# EAGLE schematic Aquila-2019-ex (EAGLE 9.2.1)
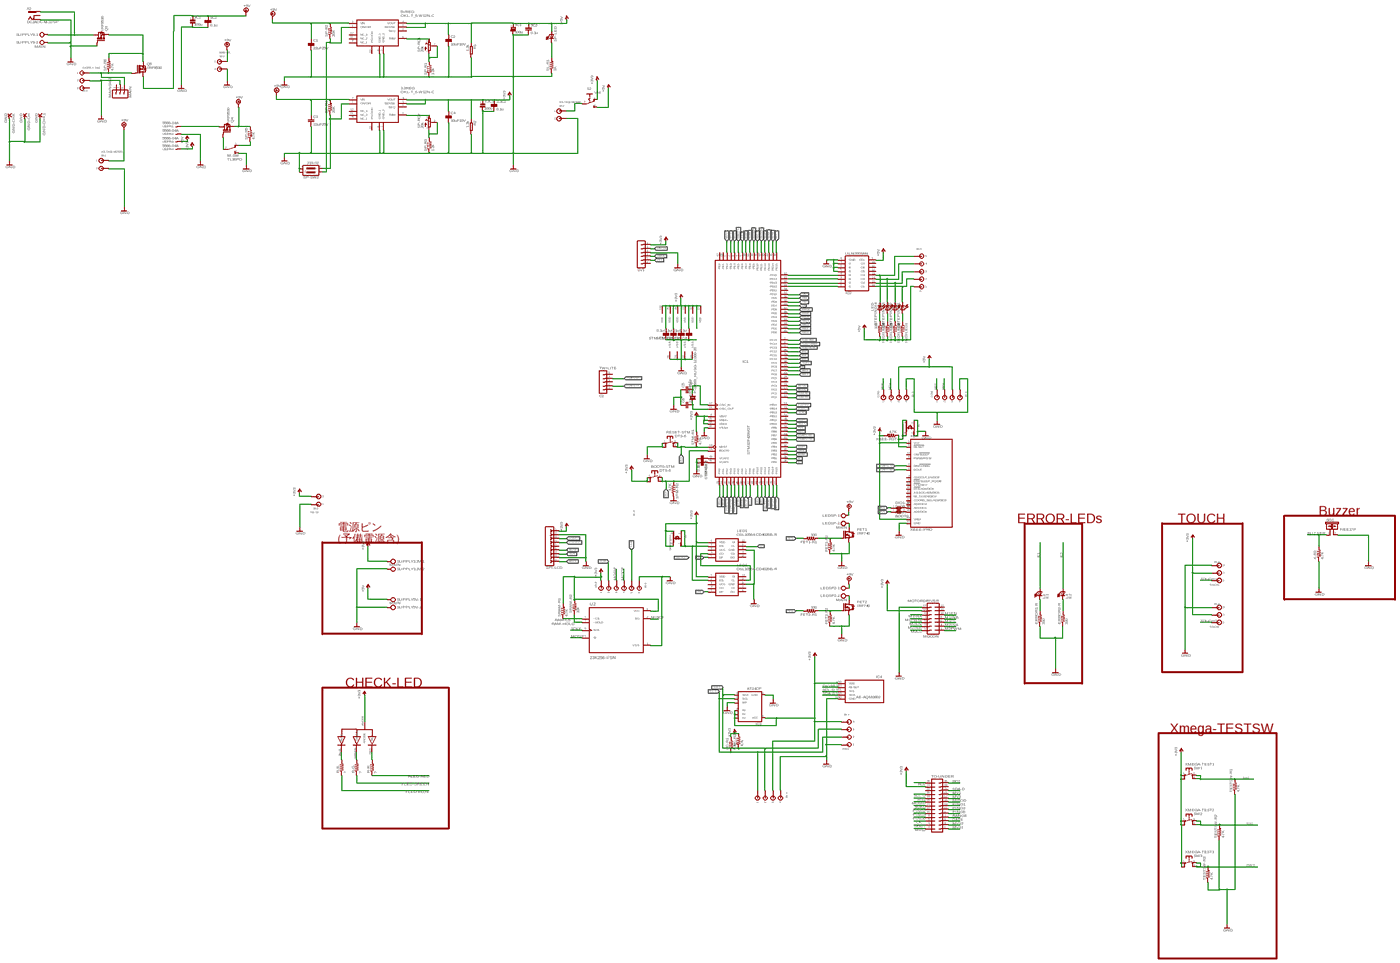
[diagram p0: schematic, sheet 1, overview]
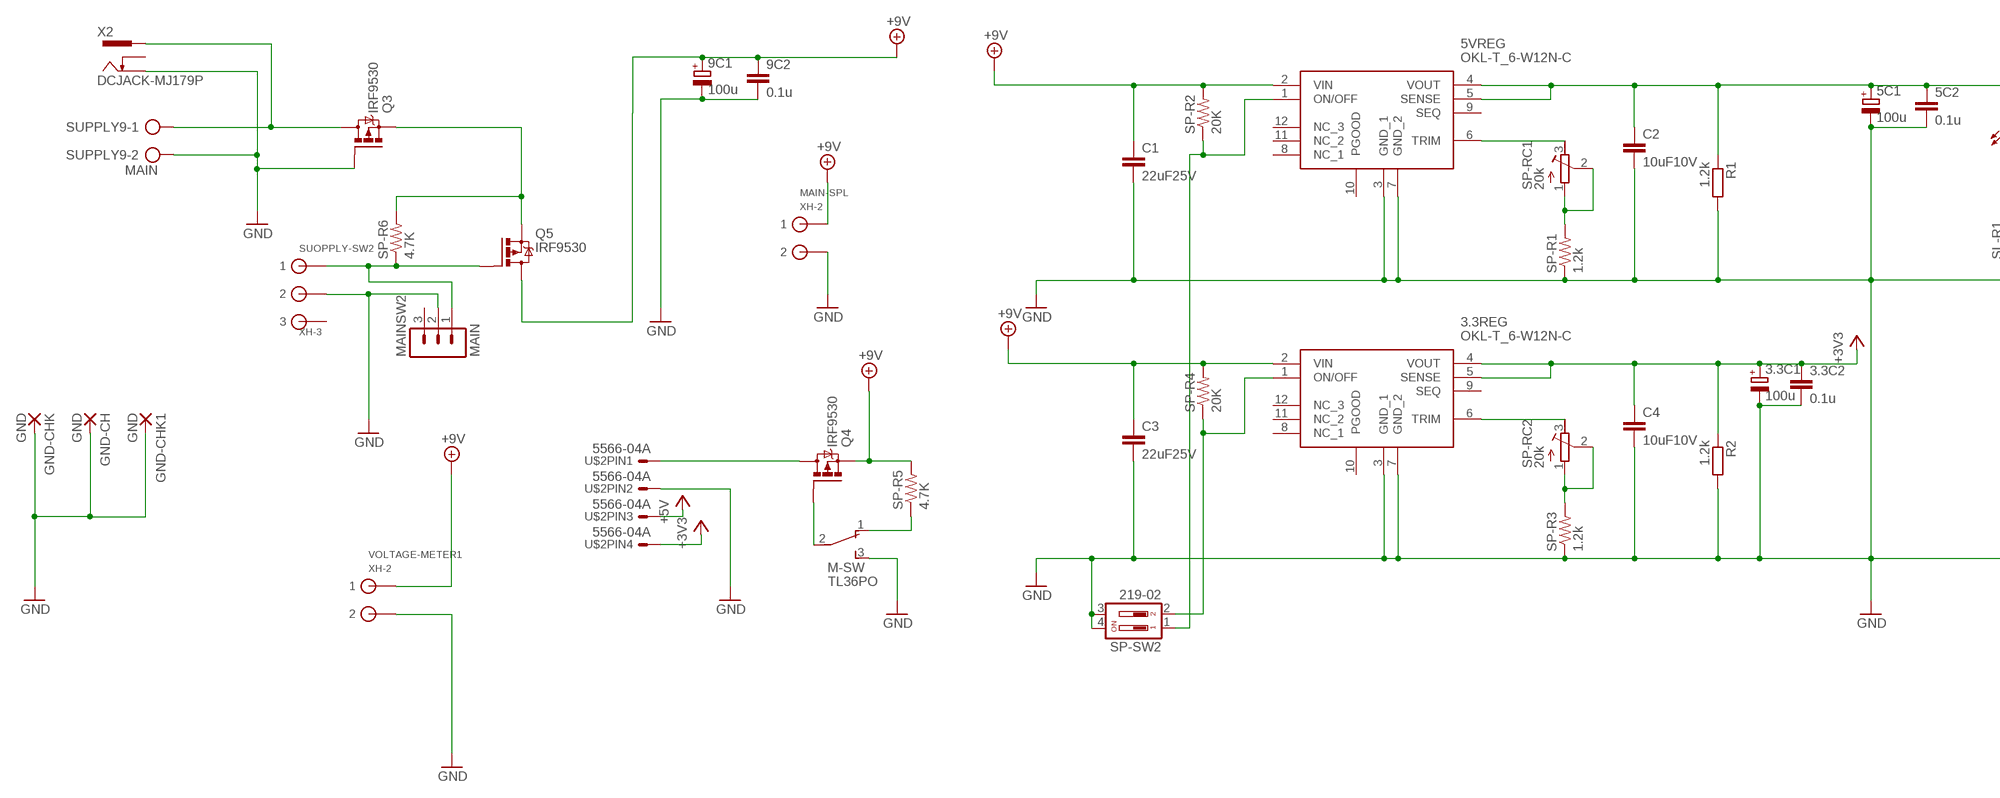
[diagram p1: schematic, sheet 1, part 1 of 5]
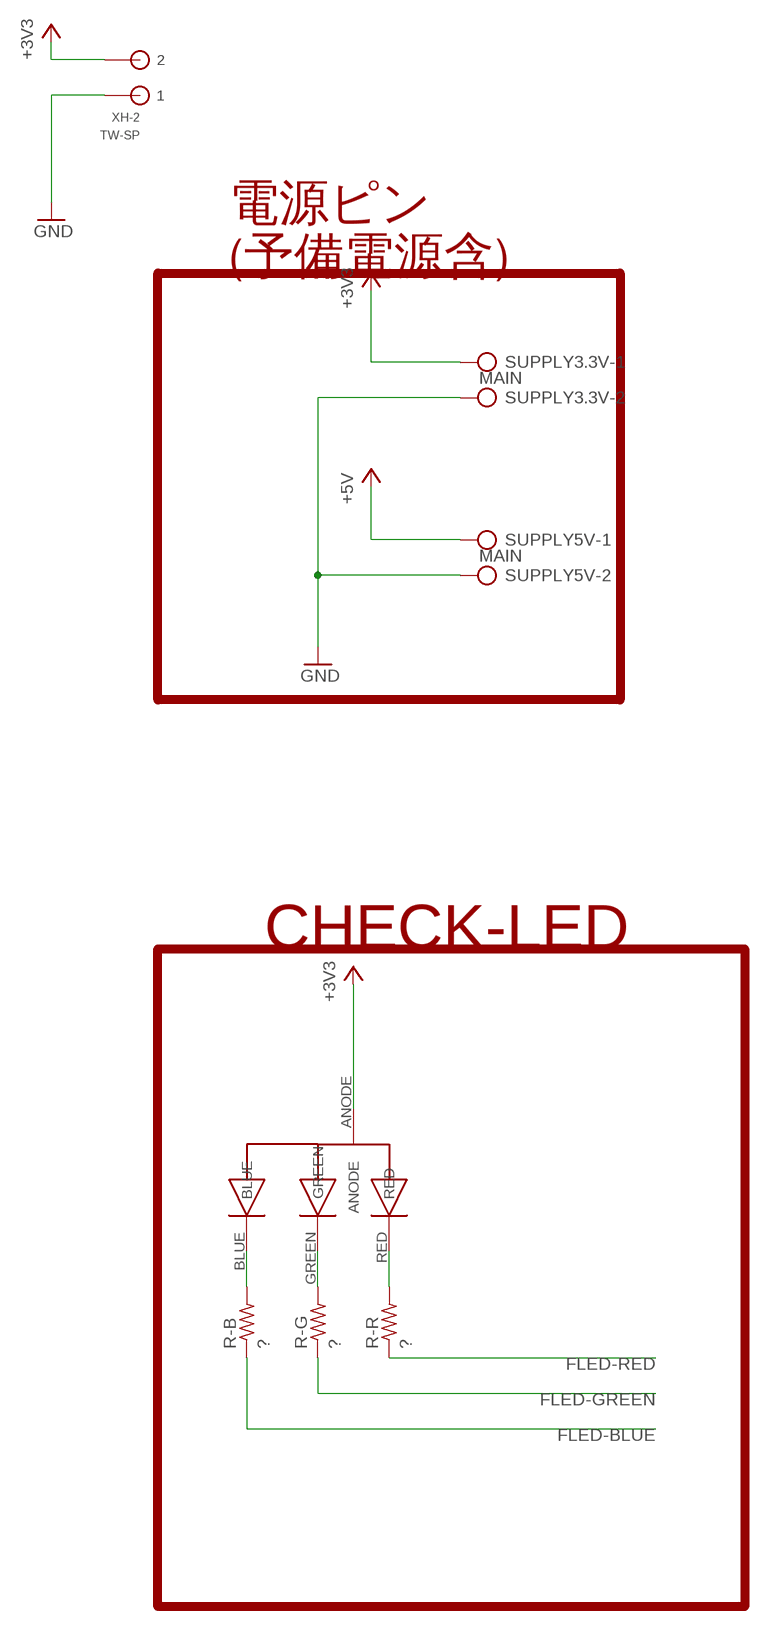
[diagram p2: schematic, sheet 1, part 2 of 5]
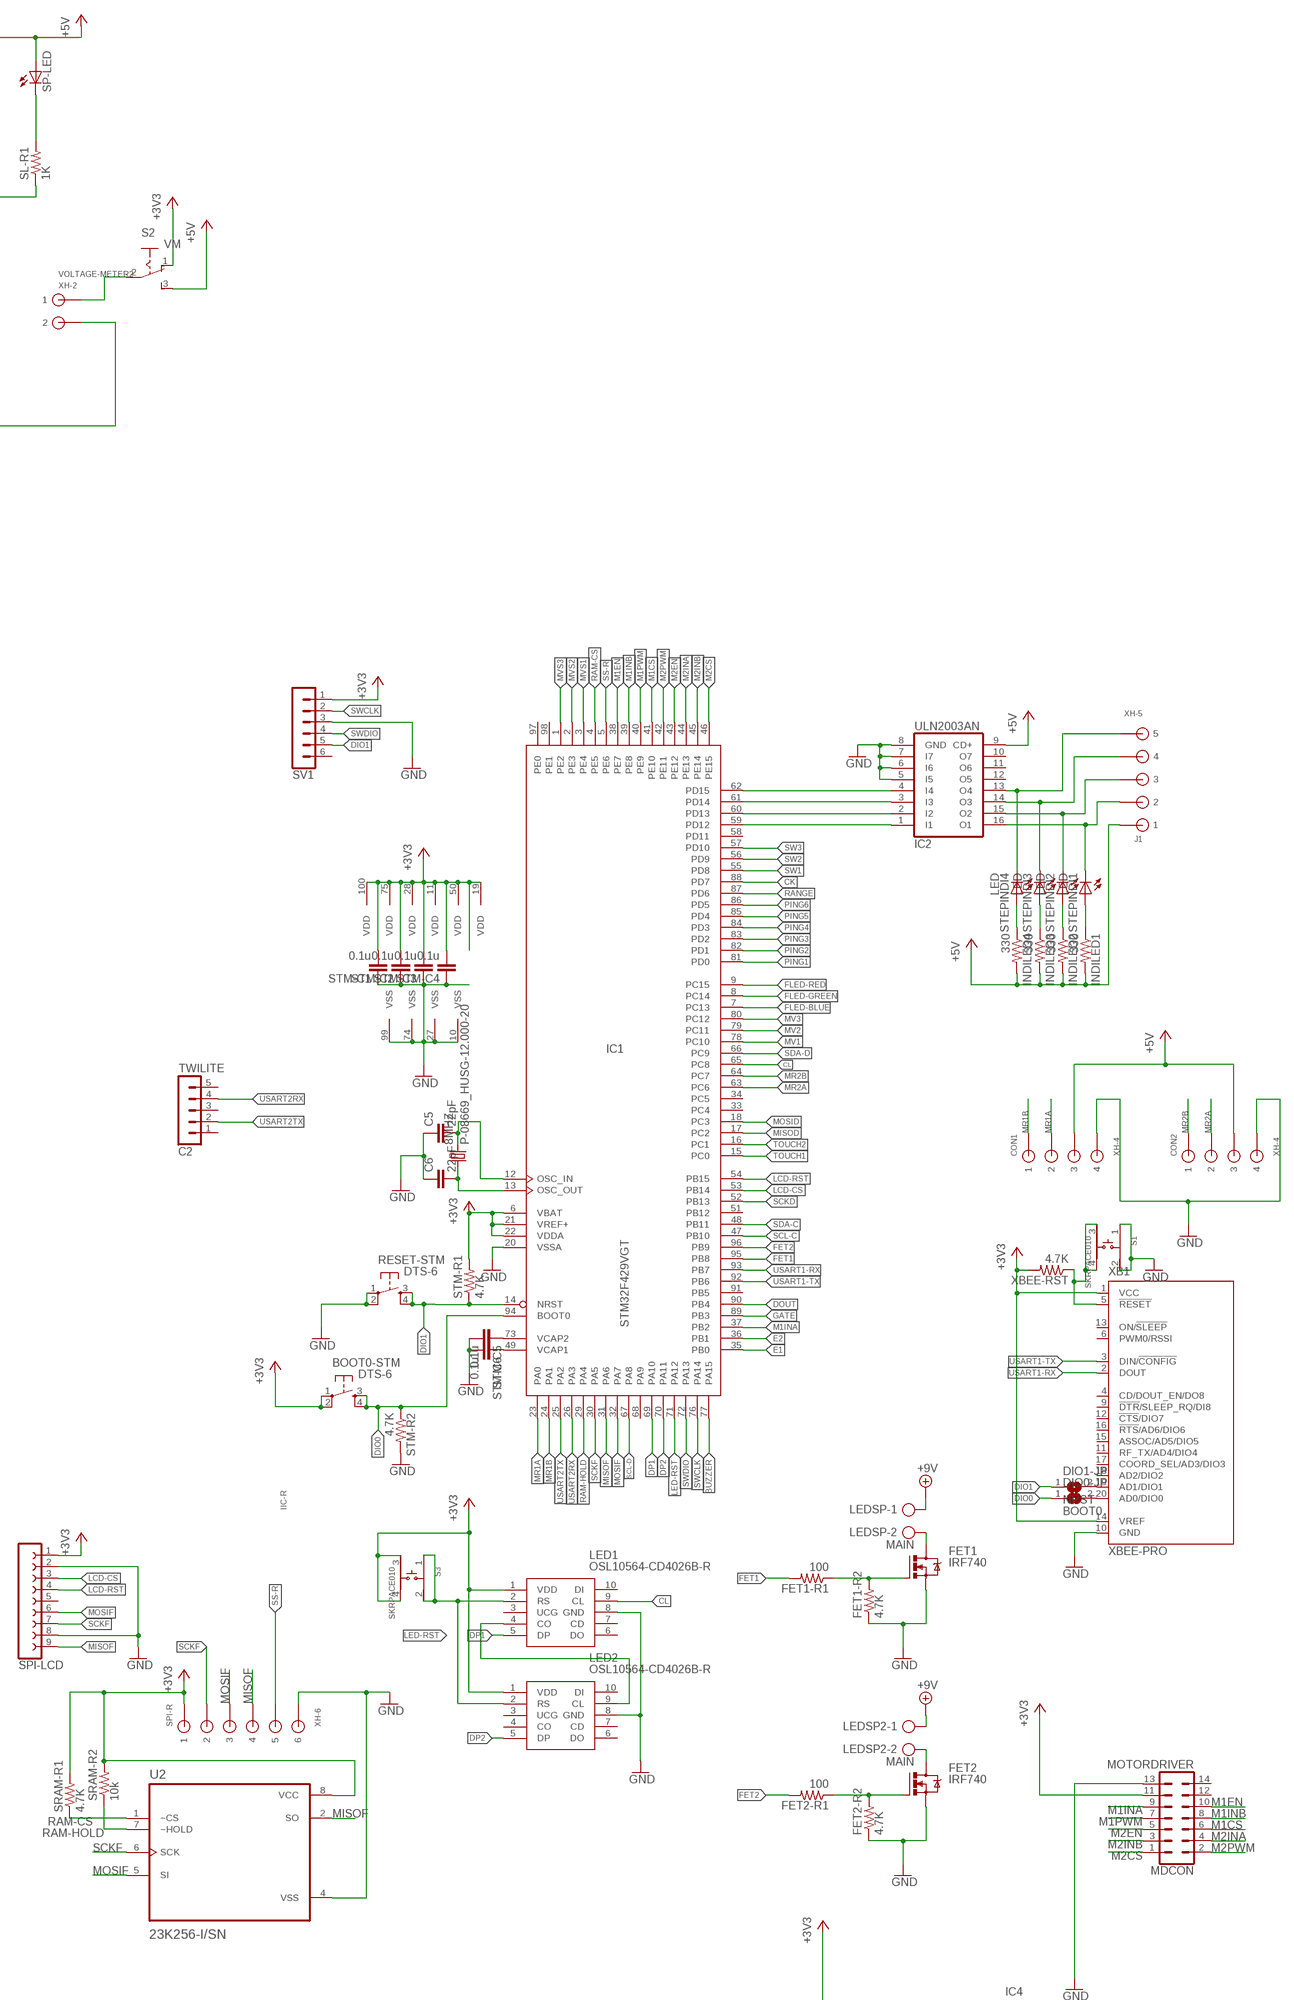
[diagram p3: schematic, sheet 1, part 3 of 5]
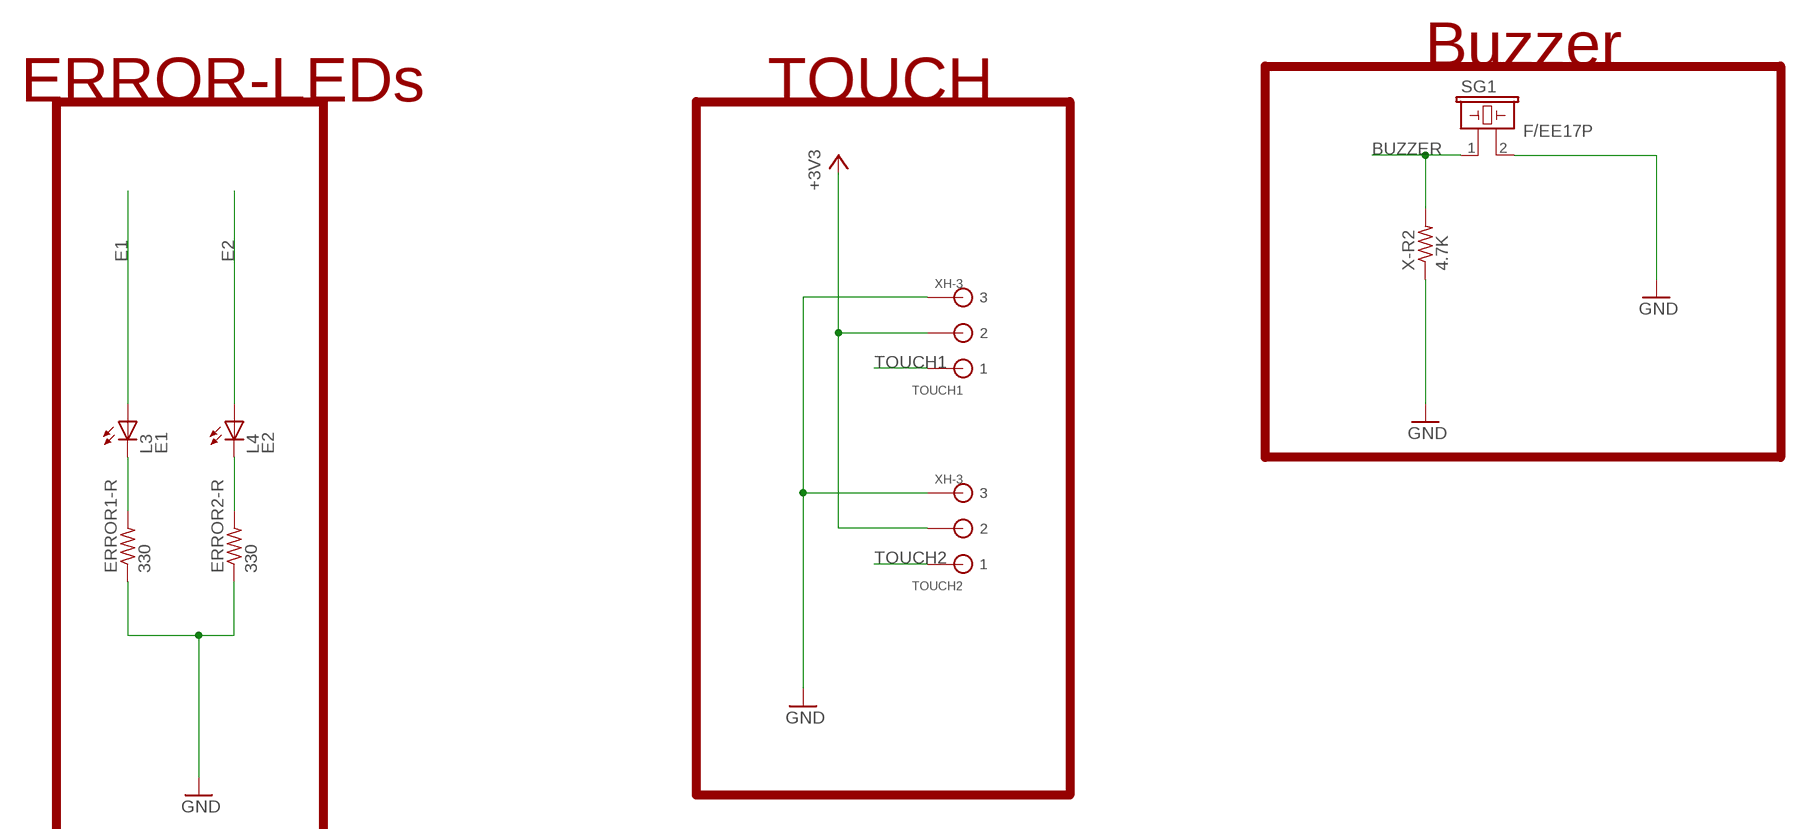
[diagram p4: schematic, sheet 1, part 4 of 5]
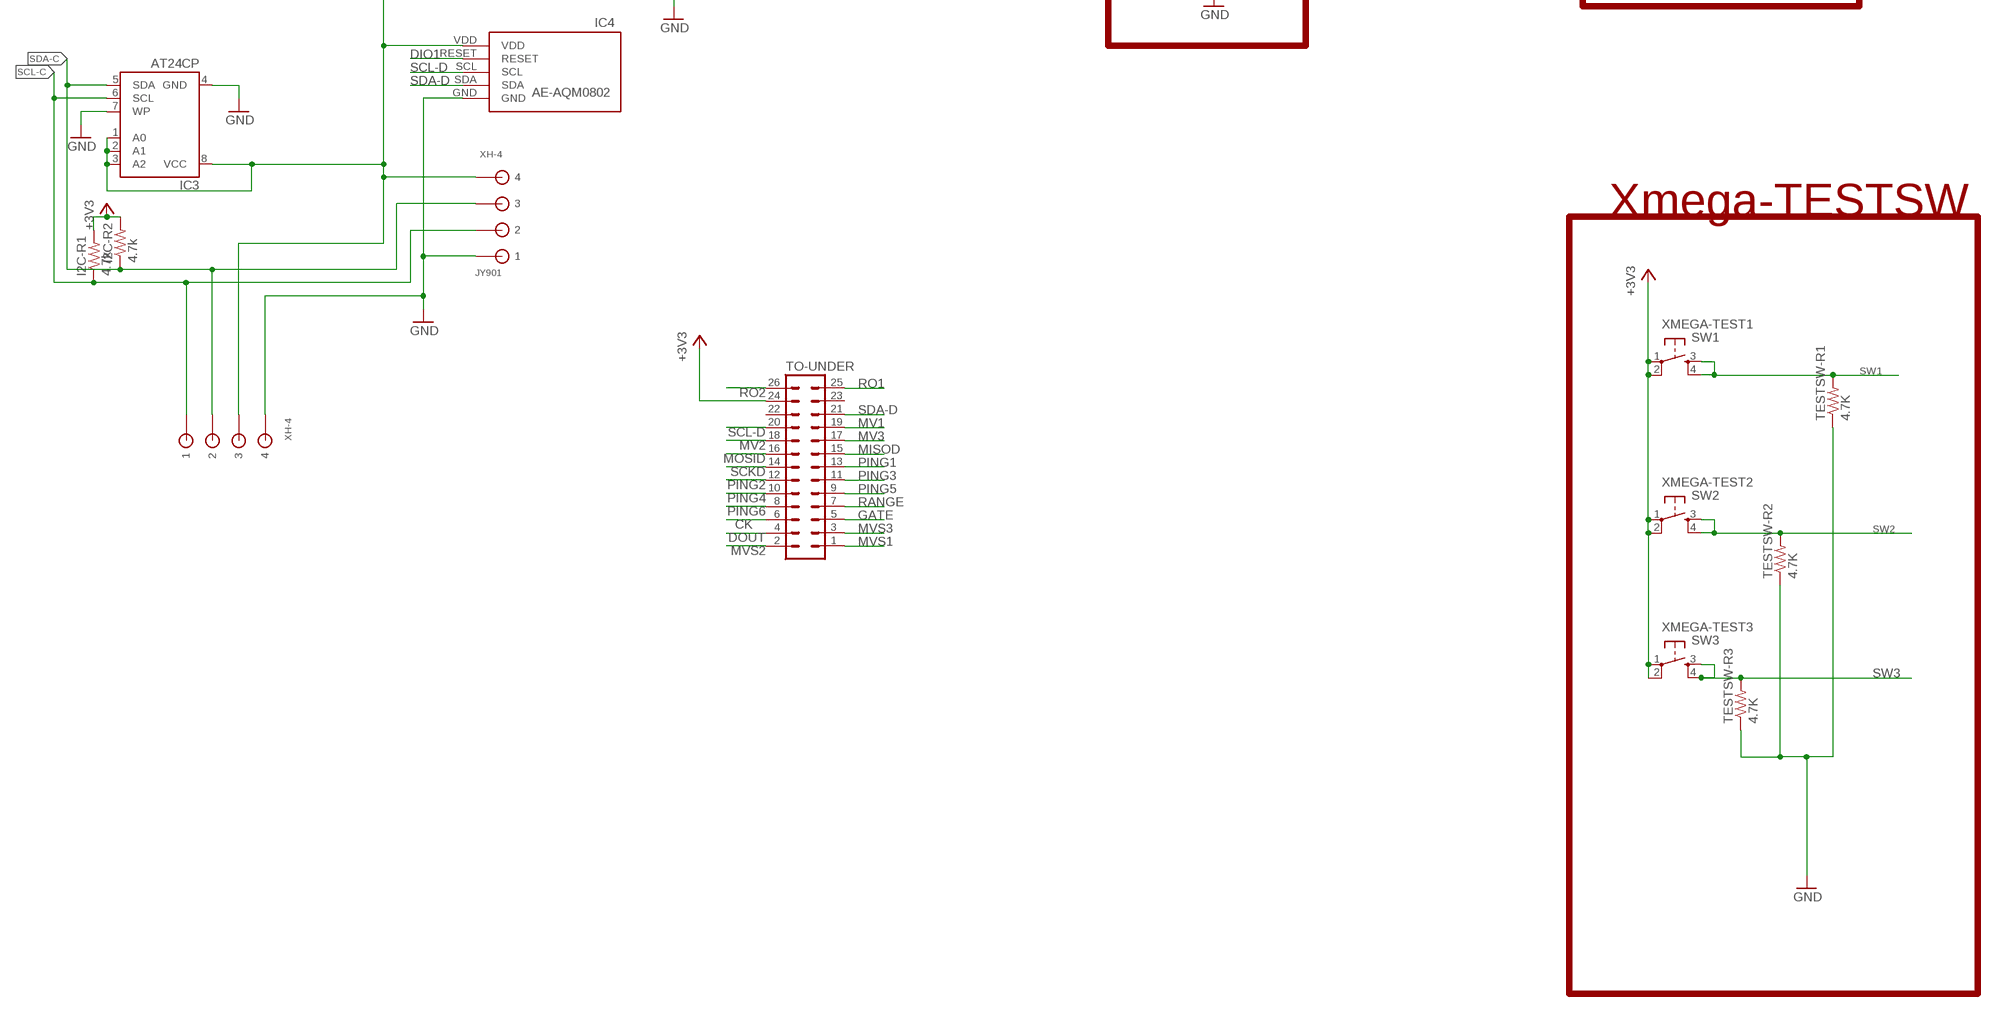
[diagram p5: schematic, sheet 1, part 5 of 5]

## Parts
3.3C1  100u  CPOL-EUD/7343-31R  [D/7343-31R]
3.3C2  0.1u  C-EUC0805  [C0805]
3.3REG  OKL-T_6-W12N-C  [OKL-T/3-W5]
5C1  100u  CPOL-EUD/7343-31R  [D/7343-31R]
5C2  0.1u  C-EUC0805  [C0805]
5VREG  OKL-T_6-W12N-C  [OKL-T/3-W5]
8MHZ  P-08669_HUSG-12.000-20  [HC49U-V]
9C1  100u  CPOL-EUD/7343-31R  [D/7343-31R]
9C2  0.1u  C-EUC0805  [C0805]
BOOT0-STM  DTS-6  [DTS-6]
C1  22uF25V  C-EUC2012  [C2012]
C2  10uF10V  C-EUC2012  [C2012]
C3  22uF25V  C-EUC2012  [C2012]
C4  10uF10V  C-EUC2012  [C2012]
C5  22pF  C-EUC1608  [C1608]
C6  22pF  C-EUC1608  [C1608]
CHECKLED  OSTA71A1D-A  [OSTA71A1D-A]
CON1  XH-4  [CON4]
CON2  XH-4  [CON4]
DIO0-JP  BOOT0  SJ  [SJ]
DIO1-JP  NRST  SJ  [SJ]
ERROR1-R  330  R-US_R0805  [R0805]
ERROR2-R  330  R-US_R0805  [R0805]
FET1  IRF740  [TO220BV]
FET1-R1  100  R-US_R0805  [R0805]
FET1-R2  4.7K  R-US_R0805  [R0805]
FET2  IRF740  [TO220BV]
FET2-R1  100  R-US_R0805  [R0805]
FET2-R2  4.7K  R-US_R0805  [R0805]
GND-CH  GND  SMD5  [SMD2,54-5,08]
GND-CHK  GND  2,15/1,0  [2,15/1,0]
GND-CHK1  GND  2,15/1,0  [2,15/1,0]
I2C-R1  4.7k  R-US_R0805  [R0805]
I2C-R2  4.7k  R-US_R0805  [R0805]
IC1  STM32F429VGT  [LQFP100]
IC2  ULN2003AN  [DIL16]
IC3  AT24CP  [DIL08]
IC4  AE-AQM0802  [AE-AQM0802]
IIC-R  XH-4  [CON4]
INDILED1  330  R-US_R0805  [R0805]
INDILED2  330  R-US_R0805  [R0805]
INDILED3  330  R-US_R0805  [R0805]
INDILED4  330  R-US_R0805  [R0805]
J1  XH-5  [CON5]
JY901  XH-4  [CON4]
L3  E1  LED5MM  [LED5MM]
L4  E2  LED5MM  [LED5MM]
LED1  OSL10564-CD4026B-R  [DIPS1524W50P254L1260H800Q10N]
LED2  OSL10564-CD4026B-R  [DIPS1524W50P254L1260H800Q10N]
LEDSP  MAIN  AK500/2  [AK500/2]
LEDSP2  MAIN  AK500/2  [AK500/2]
M-SW  TL36PO  [TL3XPO]
MAIN-SPL  XH-2  [CON2]
MAINSW2  MAIN  MA03-1  [MA03-1]
MOTORDRIVER  MDCON  ML14  [ML14]
Q3  IRF9530  [TO220BV]
Q4  IRF9530  [TO220BV]
Q5  IRF9530  [TO220BV]
R1  1.2k  R-EU_0204/7  [0204/7]
R2  1.2k  R-EU_0204/7  [0204/7]
R-B  ?  R-US_R0805  [R0805]
R-G  ?  R-US_R0805  [R0805]
R-R  ?  R-US_R0805  [R0805]
RESET-STM  DTS-6  [DTS-6]
S1  SKRPACE010  [SW_SKRPACE010]
S2  VM  M251  [M251]
S3  SKRPACE010  [SW_SKRPACE010]
SG1  F/EE17P  [F/EE17P]
SL-R1  1K  R-US_R0805  [R0805]
SP-LED  LEDCHIPLED_0805  [CHIPLED_0805]
SP-R1  1.2k  R-US_R0805  [R0805]
SP-R2  20K  R-US_R0805  [R0805]
SP-R3  1.2k  R-US_R0805  [R0805]
SP-R4  20K  R-US_R0805  [R0805]
SP-R5  4.7K  R-US_R0805  [R0805]
SP-R6  4.7K  R-US_R0805  [R0805]
SP-RC1  20k  R-TRIMM3296W  [RTRIM3296W]
SP-RC2  20k  R-TRIMM3296W  [RTRIM3296W]
SP-SW2  219-02  [CTS-219-02]
SPI-LCD  FE09-1  [FE09]
SPI-R  XH-6  [CON6]
SRAM-R1  4.7K  R-US_R0805  [R0805]
SRAM-R2  10k  R-US_R0805  [R0805]
STEPINDI1  LED  LEDCHIPLED_0805  [CHIPLED_0805]
STEPINDI2  LED  LEDCHIPLED_0805  [CHIPLED_0805]
STEPINDI3  LED  LEDCHIPLED_0805  [CHIPLED_0805]
STEPINDI4  LED  LEDCHIPLED_0805  [CHIPLED_0805]
STM-C1  0.1u  C-EUC0805  [C0805]
STM-C2  0.1u  C-EUC0805  [C0805]
STM-C3  0.1u  C-EUC0805  [C0805]
STM-C4  0.1u  C-EUC0805  [C0805]
STM-C5  0.1u  C-EUC0805  [C0805]
STM-C6  0.1u  C-EUC0805  [C0805]
STM-R1  4.7K  R-US_R0805  [R0805]
STM-R2  4.7K  R-US_R0805  [R0805]
SUOPPLY-SW2  XH-3  [CON3]
SUPPLY3.3V  MAIN  AK500/2  [AK500/2]
SUPPLY5V  MAIN  AK500/2  [AK500/2]
SUPPLY9  MAIN  AK500/2  [AK500/2]
SV1  MA06-1  [MA06-1]
TESTSW-R1  4.7K  R-US_R0805  [R0805]
TESTSW-R2  4.7K  R-US_R0805  [R0805]
TESTSW-R3  4.7K  R-US_R0805  [R0805]
TO-UNDER  ML26  [ML26]
TOUCH1  XH-3  [CON3]
TOUCH2  XH-3  [CON3]
TW-SP  XH-2  [CON2]
TWILITE  C2  MA05-1  [MA05-1]
U2  23K256-I/SN  [SOIC127P600X175-8N]
U$2  5566-04A  [5566-04A]
VOLTAGE-METER1  XH-2  [CON2]
VOLTAGE-METER2  XH-2  [CON2]
X2  DCJACK-MJ179P  [MJ-179P]
X-R2  4.7K  R-US_R0805  [R0805]
XB1  XBEE-PRO  [XBEE-PRO]
XBEE-RST  4.7K  R-US_R0805  [R0805]
XMEGA-TEST1  SW1  DTS-6  [DTS-6]
XMEGA-TEST2  SW2  DTS-6  [DTS-6]
XMEGA-TEST3  SW3  DTS-6  [DTS-6]

## Nets
+3V3: 3.3C1.+ 3.3C2.1 3.3REG.4(VOUT) 3.3REG.5(SENSE) BOOT0-STM.1 BOOT0-STM.2 C4.1 CHECKLED.ANODE I2C-R1.2 I2C-R2.2 IC1.6(VBAT) IC1.11(VDD) IC1.19(VDD) IC1.21(VREF+) IC1.22(VDDA) IC1.28(VDD) IC1.50(VDD) IC1.75(VDD) IC1.100(VDD) IC3.1(A0) IC3.2(A1) IC3.3(A2) IC3.8(VCC) IC4.VDD IIC-R.P$3 JY901.P$4 LED1.1(VDD) LED2.1(VDD) MOTORDRIVER.11 R2.1 S2.1(O) S3.3 S3.4 SPI-LCD.1 SPI-R.P$1 SRAM-R1.2 SRAM-R2.2 STM-C1.2 STM-C2.2 STM-C3.2 STM-C4.2 STM-R1.2 SUPPLY3.3V.1 SV1.1 TO-UNDER.24 TOUCH1.P$2 TOUCH2.P$2 TW-SP.P$2 U2.8(VCC) U$2.4 XB1.1(VCC) XB1.14(VREF) XBEE-RST.2 XMEGA-TEST1.1 XMEGA-TEST1.2 XMEGA-TEST2.1 XMEGA-TEST2.2 XMEGA-TEST3.1 XMEGA-TEST3.2
+5V: 5C1.+ 5C2.1 5VREG.4(VOUT) 5VREG.5(SENSE) C2.1 CON1.P$3 CON2.P$3 IC2.9(CD+) INDILED1.2 INDILED2.2 INDILED3.2 INDILED4.2 J1.P$1 R1.1 S2.3(S) SP-LED.A SUPPLY5V.1 U$2.3
+9V: 3.3REG.2(VIN) 5VREG.2(VIN) 9C1.+ 9C2.1 C1.1 C3.1 LEDSP2.1 LEDSP.1 MAIN-SPL.P$1 Q4.S Q5.D SP-R2.2 SP-R4.2 SP-R5.2 VOLTAGE-METER1.P$1
BUZZER: IC1.77(PA15) SG1.1 X-R2.2
CK: IC1.88(PD7) TO-UNDER.6
CL: IC1.65(PC8) LED1.9(CL)
DIO0: BOOT0-STM.3 BOOT0-STM.4 DIO0-JP.1 IC1.94(BOOT0) STM-R2.1
DIO1: DIO1-JP.1 IC1.14(NRST) IC4.RESET RESET-STM.3 RESET-STM.4 STM-R1.1 SV1.5
DOUT: IC1.90(PB4) TO-UNDER.4
DP1: IC1.69(PA10) LED1.5(DP)
DP2: IC1.70(PA11) LED2.5(DP)
E1: IC1.35(PB0) L3.A
E2: IC1.36(PB1) L4.A
FET1: FET1-R1.2 IC1.95(PB8)
FET2: FET2-R1.2 IC1.96(PB9)
FLED-BLUE: IC1.7(PC13) R-B.1
FLED-GREEN: IC1.8(PC14) R-G.1
FLED-RED: IC1.9(PC15) R-R.1
GATE: IC1.89(PB3) TO-UNDER.5
GND: 3.3C1.- 3.3C2.2 3.3REG.3(GND_1) 3.3REG.7(GND_2) 5C1.- 5C2.2 5VREG.3(GND_1) 5VREG.7(GND_2) 9C1.- 9C2.2 C1.2 C2.2 C3.2 C4.2 C5.1 C6.1 CON1.P$4 CON2.P$4 ERROR1-R.1 ERROR2-R.1 FET1-R2.1 FET1.S FET2-R2.1 FET2.S GND-CH.1(P) GND-CHK1.1(P) GND-CHK.1(P) IC1.10(VSS) IC1.20(VSSA) IC1.27(VSS) IC1.74(VSS) IC1.99(VSS) IC2.5(I5) IC2.6(I6) IC2.7(I7) IC2.8(GND) IC3.4(GND) IC3.7(WP) IC4.GND IIC-R.P$4 JY901.P$1 LED1.8(GND) LED2.8(GND) M-SW.3(S) MAIN-SPL.P$2 MAINSW2.2 MOTORDRIVER.13 Q3.G R1.2 R2.2 RESET-STM.1 RESET-STM.2 S1.1 S1.2 SG1.2 SL-R1.1 SP-R1.1 SP-R3.1 SP-SW2.3 SP-SW2.4 SPI-LCD.2 SPI-LCD.8 SPI-R.P$6 STM-C1.1 STM-C2.1 STM-C3.1 STM-C4.1 STM-C5.2 STM-C6.2 STM-R2.2 SUOPPLY-SW2.P$2 SUPPLY3.3V.2 SUPPLY5V.2 SUPPLY9.2 SV1.3 TESTSW-R1.1 TESTSW-R2.1 TESTSW-R3.1 TOUCH1.P$3 TOUCH2.P$3 TW-SP.P$1 U2.4(VSS) U$2.2 VOLTAGE-METER1.P$2 VOLTAGE-METER2.P$2 X2.2 X-R2.1 XB1.10(GND)
LCD-CS: IC1.53(PB14) SPI-LCD.3
LCD-RST: IC1.54(PB15) SPI-LCD.4
LED-RST: IC1.71(PA12) LED1.2(RS) LED2.2(RS) S3.1 S3.2
M1CS: IC1.41(PE10) MOTORDRIVER.6
M1EN: IC1.38(PE7) MOTORDRIVER.10
M1INA: IC1.37(PB2) MOTORDRIVER.9
M1INB: IC1.39(PE8) MOTORDRIVER.8
M1PWM: IC1.40(PE9) MOTORDRIVER.7
M2CS: IC1.46(PE15) MOTORDRIVER.1
M2EN: IC1.43(PE12) MOTORDRIVER.5
M2INA: IC1.44(PE13) MOTORDRIVER.4
M2INB: IC1.45(PE14) MOTORDRIVER.3
M2PWM: IC1.42(PE11) MOTORDRIVER.2
MISOD: IC1.17(PC2) TO-UNDER.15
MISOF: IC1.31(PA6) SPI-LCD.9 SPI-R.P$4 U2.2(SO)
MOSID: IC1.18(PC3) TO-UNDER.16
MOSIF: IC1.32(PA7) SPI-LCD.6 SPI-R.P$3 U2.5(SI)
MR1A: CON1.P$2 IC1.23(PA0)
MR1B: CON1.P$1 IC1.24(PA1)
MR2A: CON2.P$2 IC1.63(PC6)
MR2B: CON2.P$1 IC1.64(PC7)
MV1: IC1.78(PC10) TO-UNDER.19
MV2: IC1.79(PC11) TO-UNDER.18
MV3: IC1.80(PC12) TO-UNDER.17
MVS1: IC1.3(PE4) TO-UNDER.1
MVS2: IC1.2(PE3) TO-UNDER.2
MVS3: IC1.1(PE2) TO-UNDER.3
N$1: IC1.62(PD15) IC2.4(I4)
N$2: DIO1-JP.2 XB1.19(AD1/DIO1)
N$3: SP-R1.2 SP-RC1.1(A) SP-RC1.2(S)
N$4: IC1.61(PD14) IC2.3(I3)
N$5: Q3.S Q5.S SP-R6.2
N$6: Q4.D U$2.1
N$7: SP-R3.2 SP-RC2.1(A) SP-RC2.2(S)
N$8: M-SW.2(P) Q4.G
N$9: 5VREG.6(TRIM) SP-RC1.3(E)
N$10: M-SW.1(O) SP-R5.1
N$11: S2.2(P) VOLTAGE-METER2.P$1
N$12: IC1.60(PD13) IC2.2(I2)
N$13: 3.3REG.6(TRIM) SP-RC2.3(E)
N$14: IC1.59(PD12) IC2.1(I1)
N$15: 3.3REG.1(ON/OFF) SP-R4.1 SP-SW2.2
N$16: IC2.16(O1) J1.P$2 STEPINDI1.C
N$17: IC2.15(O2) J1.P$3 STEPINDI2.C
N$18: IC2.14(O3) J1.P$4 STEPINDI3.C
N$19: IC2.13(O4) J1.P$5 STEPINDI4.C
N$20: INDILED4.1 STEPINDI4.A
N$21: INDILED3.1 STEPINDI3.A
N$22: INDILED2.1 STEPINDI2.A
N$23: INDILED1.1 STEPINDI1.A
N$24: SL-R1.2 SP-LED.C
N$25: 8MHZ.1 C6.2 IC1.13(OSC_OUT)
N$26: 5VREG.1(ON/OFF) SP-R2.1 SP-SW2.1
N$31: 8MHZ.2 C5.2 IC1.12(OSC_IN)
N$32: FET1-R1.1 FET1-R2.2 FET1.G
N$33: FET1.D LEDSP.2
N$34: FET2-R1.1 FET2-R2.2 FET2.G
N$35: FET2.D LEDSP2.2
N$36: IC1.73(VCAP2) STM-C5.1
N$37: IC1.49(VCAP1) STM-C6.1
N$38: Q3.D SUPPLY9.1 X2.1
N$39: DIO0-JP.2 XB1.20(AD0/DIO0)
N$40: MAINSW2.1 Q5.G SP-R6.1 SUOPPLY-SW2.P$1
N$42: S1.3 S1.4 XB1.5(!RESET) XBEE-RST.1
N$46: ERROR1-R.2 L3.K(C)
N$47: ERROR2-R.2 L4.K(C)
N$50: LED1.4(CO) LED2.9(CL)
N$56: CHECKLED.RED R-R.2
N$57: CHECKLED.GREEN R-G.2
N$58: CHECKLED.BLUE R-B.2
PING1: IC1.81(PD0) TO-UNDER.13
PING2: IC1.82(PD1) TO-UNDER.12
PING3: IC1.83(PD2) TO-UNDER.11
PING4: IC1.84(PD3) TO-UNDER.10
PING5: IC1.85(PD4) TO-UNDER.9
PING6: IC1.86(PD5) TO-UNDER.8
RAM-CS: IC1.4(PE5) SRAM-R1.1 U2.1(~CS)
RAM-HOLD: IC1.29(PA4) SRAM-R2.1 U2.7(~HOLD)
RANGE: IC1.87(PD6) TO-UNDER.7
RO1: TO-UNDER.25
RO2: TO-UNDER.26
SCKD: IC1.52(PB13) TO-UNDER.14
SCKF: IC1.30(PA5) SPI-LCD.7 SPI-R.P$2 U2.6(SCK)
SCL-C: I2C-R1.1 IC1.47(PB10) IC3.6(SCL) IIC-R.P$1 JY901.P$2
SCL-D: IC1.67(PA8) IC4.SCL TO-UNDER.20
SDA-C: I2C-R2.1 IC1.48(PB11) IC3.5(SDA) IIC-R.P$2 JY901.P$3
SDA-D: IC1.66(PC9) IC4.SDA TO-UNDER.21
SS-R: IC1.5(PE6) SPI-R.P$5
SW1: IC1.55(PD8) TESTSW-R1.2 XMEGA-TEST1.3 XMEGA-TEST1.4
SW2: IC1.56(PD9) TESTSW-R2.2 XMEGA-TEST2.3 XMEGA-TEST2.4
SW3: IC1.57(PD10) TESTSW-R3.2 XMEGA-TEST3.3 XMEGA-TEST3.4
SWCLK: IC1.76(PA14) SV1.2
SWDIO: IC1.72(PA13) SV1.4
TOUCH1: IC1.15(PC0) TOUCH1.P$1
TOUCH2: IC1.16(PC1) TOUCH2.P$1
USART1-RX: IC1.93(PB7) XB1.2(DOUT)
USART1-TX: IC1.92(PB6) XB1.3(DIN/!CONFIG)
USART2RX: IC1.26(PA3) TWILITE.4
USART2TX: IC1.25(PA2) TWILITE.2
Unconnected: 3.3REG.8(NC_1) 3.3REG.9(SEQ) 3.3REG.10(PGOOD) 3.3REG.11(NC_2) 3.3REG.12(NC_3) 5VREG.8(NC_1) 5VREG.9(SEQ) 5VREG.10(PGOOD) 5VREG.11(NC_2) 5VREG.12(NC_3) IC1.33(PC4) IC1.34(PC5) IC1.51(PB12) IC1.58(PD11) IC1.68(PA9) IC1.91(PB5) IC1.97(PE0) IC1.98(PE1) IC2.10(O7) IC2.11(O6) IC2.12(O5) LED1.3(UCG) LED1.6(DO) LED1.7(CD) LED1.10(DI) LED2.3(UCG) LED2.4(CO) LED2.6(DO) LED2.7(CD) LED2.10(DI) MAINSW2.3 MOTORDRIVER.12 MOTORDRIVER.14 SPI-LCD.5 SUOPPLY-SW2.P$3 SV1.6 TO-UNDER.22 TO-UNDER.23 TWILITE.1 TWILITE.3 TWILITE.5 X2.3 XB1.4(CD/DOUT_EN/DO8) XB1.6(PWM0/RSSI) XB1.9(!DTR!/SLEEP_RQ/DI8) XB1.11(RF_TX/AD4/DIO4) XB1.12(!CTS!/DIO7) XB1.13(ON/!SLEEP) XB1.15(ASSOC/AD5/DIO5) XB1.16(!RTS!/AD6/DIO6) XB1.17(COORD_SEL/AD3/DIO3) XB1.18(AD2/DIO2)

## Notes on the sheet
- Buzzer
- ERROR-LEDs | TOUCH
- 電源ピン
  (予備電源含)
- CHECK-LED
- Xmega-TESTSW

## Library data of the parts
3.3C1 5C1 9C1 = rcl:CPOL-EU: POLARIZED CAPACITOR, European symbol; SPICEPREFIX: B
3.3C2 5C2 9C2 = rcl:C-EU: CAPACITOR, European symbol; SPICEPREFIX: B
3.3REG 5VREG = SamacSys_Parts:OKL-T_6-W12N-C: MURATA POWER SOLUTIONS - OKL-T/6-W12N-C - DC/DC CONVERTER, 30W, ADJ OUTPUT Source: Datasheet <http://www.mouser.com/ds/2/281/okl-t6-w12-21493.pdf>; ARROW_PART_NUMBER: OKL-T/6-W12N-C; ARROW_PRICE/STOCK: https://www.arrow.com/en/products/okl-t6-w12n-c/murata-power-solutions; DESCRIPTION: MURATA POWER SOLUTIONS - OKL-T/6-W12N-C - DC/DC CONVERTER, 30W, ADJ OUTPUT; HEIGHT: mm; MANUFACTURER_NAME: Murata Electronics; MANUFACTURER_PART_NUMBER: OKL-T/6-W12N-C; RS_PART_NUMBER: 1736944P; RS_PRICE/STOCK: http://uk.rs-online.com/web/p/products/1736944P
8MHZ = Akizuki:P-08669_HUSG-12.000-20
BOOT0-STM RESET-STM XMEGA-TEST1-XMEGA-TEST3 = forprint:DTS-6
C1-C6 = resistor:C-EU: CAPACITOR, European symbol
CHECKLED = FullColorLed-forprint:OSTA71A1D-A
CON1 CON2 IIC-R JY901 = 0@Mylibrary-main1:XH-4: Low insertion connector 4pin
DIO0-JP DIO1-JP = jumper:SJ: SMD solder JUMPER
ERROR1-R ERROR2-R FET1-R1 FET1-R2 FET2-R1 FET2-R2 I2C-R1 I2C-R2 INDILED1-INDILED4 R-B R-G R-R SL-R1 SP-R1-SP-R6 SRAM-R1 SRAM-R2 STM-R1 STM-R2 TESTSW-R1-TESTSW-R3 X-R2 XBEE-RST = 0@Mylibrary-main1:R-US_: RESISTOR, American symbol
FET1 FET2 = transistor-power:IRF740: N-CHANNEL MOS FET
GND-CH = wirepad:SMD5: SMD PAD
GND-CHK GND-CHK1 = wirepad:2,15/1,0: THROUGH-HOLE PAD
IC1 = micro-stm_v3:STM32F429V*T: ARM 32-bit Cortex™-M3 CPU 180 MHz maximum frequency 1024 to 2048 Kbytes of Flash memory 256 kbytes of SRAM 82 GPIOs 1.8 to 3.6 V application supply
IC2 = ULN2003A:ULN2003A: DRIVER ARRAY; AVAILABILITY: Unavailable; DESCRIPTION: Trans Darlington NPN 50V 0.5A 16-Pin SOIC; MF: STMicroelectronics; MP: ULN2003A; PACKAGE: DIP-16 Rochester Electronics; PRICE: None
IC3 = atmel:AT24C*: 2-wire serial EEPROM; MPN: AT24C1024BW-SH-B; OC_FARNELL: 1362646; OC_NEWARK: 03P2044
IC4 = AE-AQM0802:AE-AQM0802: 8x2 I2C LDC Module with 0.1inch convert PCB - AE-AQM0802
J1 = 0@Mylibrary-main1:XH-5: Low insertion connector 5P
L3 L4 = 0led:LED: LED OSRAM: - CHIPLED LG R971, LG N971, LY N971, LG Q971, LY Q971, LO R971, LY R971 LH N974, LH R974 LS Q976, LO Q976, LY Q976 LO Q996 - Hyper CHIPLED LW Q18S LB Q993, LB Q99A, LB R99A - SideLED LS A670, LO A670, LY A670, LG A670, LP A670 LB A673, LV A673, LT A673, LW A673 LH A674 LY A675 LS A676, LA A676, LO A676, LY A676, LW A676 LS A679, LY A679, LG A679 - Hyper Micro SIDELED® LS Y876, LA Y876, LO Y876, LY Y876 LT Y87S - SmartLED LW L88C, LW L88S LB L89C, LB L89S, LG L890 LS L89K, LO L89K, LY L89K LS L896, LA L896, LO L896, LY L896 - TOPLED LS T670, LO T670, LY T670, LG T670, LP T670 LSG T670, LSP T670, LSY T670, LOP T670, LYG T670 LG T671, LOG T671, LSG T671 LB T673, LV T673, LT T673, LW T673 LH T674 LS T676, LA T676, LO T676, LY T676, LB T676, LH T676, LSB T676, LW T676 LB T67C, LV T67C, LT T67C, LS T67K, LO T67K, LY T67K, LW E67C LS E67B, LA E67B, LO E67B, LY E67B, LB E67C, LV E67C, LT E67C LW T67C LS T679, LY T679, LG T679 LS T770, LO T770, LY T770, LG T770, LP T770 LB T773, LV T773, LT T773, LW T773 LH T774 LS E675, LA E675, LY E675, LS T675 LS T776, LA T776, LO T776, LY T776, LB T776 LHGB T686 LT T68C, LB T68C - Hyper Mini TOPLED® LB M676 - Mini TOPLED Santana® LG M470 LS M47K, LO M47K, LY M47K Source: http://www.osram.convergy.de LUXEON: - LUMILED® LXK2-PW12-R00, LXK2-PW12-S00, LXK2-PW14-U00, LXK2-PW14-V00 LXK2-PM12-R00, LXK2-PM12-S00, LXK2-PM14-U00 LXK2-PE12-Q00, LXK2-PE12-R00, LXK2-PE12-S00, LXK2-PE14-T00, LXK2-PE14-U00 LXK2-PB12-K00, LXK2-PB12-L00, LXK2-PB12-M00, LXK2-PB14-N00, LXK2-PB14-P00, LXK2-PB14-Q00 LXK2-PR12-L00, LXK2-PR12-M00, LXK2-PR14-Q00, LXK2-PR14-R00 LXK2-PD12-Q00, LXK2-PD12-R00, LXK2-PD12-S00 LXK2-PH12-R00, LXK2-PH12-S00 LXK2-PL12-P00, LXK2-PL12-Q00, LXK2-PL12-R00 Source: www.luxeon.com KINGBRIGHT: KA-3528ASYC Source: www.kingbright.com
LED1 LED2 = OSL10564-CD4026B-R:OSL10564-CD4026B-R: NC Source: Datasheet <http://akizukidenshi.com/download/ds/optosupply/OSL10564-CD4026B.PDF>; DESCRIPTION: NC; HEIGHT: 8mm; MANUFACTURER_NAME: OptoSupply; MANUFACTURER_PART_NUMBER: OSL10564-CD4026B-R
LEDSP LEDSP2 SUPPLY3.3V SUPPLY5V SUPPLY9 = con-ptr500:AK500/2: CONNECTOR; OC_FARNELL: unknown; OC_NEWARK: unknown
M-SW = switch:TL36PO: TINY SWITCH ON - ON Source: http://www2.produktinfo.conrad.com/datenblaetter/700000-724999/705152-da-01-de-Subminiaturschalter_TL_36YO.pdf
MAIN-SPL VOLTAGE-METER1 VOLTAGE-METER2 = forprint:XH-2: low insertion CON
MAINSW2 = 0con-lstb:MA03-1: PIN HEADER; OC_FARNELL: unknown; OC_NEWARK: unknown
MOTORDRIVER = 0con-harting-ml:ML14: HARTING; OC_FARNELL: unknown; OC_NEWARK: unknown
Q3-Q5 = transistor-power:IRF9530: P-CHANNEL HEXFET POWER-MOS-FET Source: http://www.irf.com/product-info/datasheets/data/irf9530.pdf
R1 R2 = resistor:R-EU_: RESISTOR, European symbol
S1 S3 = SKRPACE010:SKRPACE010: Switch Tactile N.O. SPST Button J-Bend 0.05A 16VDC 2.55N SMD Automotive T/R; AVAILABILITY: Unavailable; DESCRIPTION: Switch Tactile N.O. SPST Button J-Bend 0.05A 16VDC 2.55N SMD Automotive T/R; MF: ALPS; MP: SKRPACE010; PACKAGE: None; PRICE: None
S2 = switch:M251: SLIDING SWITCH Mors, distributor Buerklin, 11G702
SG1 = buzzer:F/EE17P: BUZZER Source: Buerklin; OC_FARNELL: unknown; OC_NEWARK: unknown
SP-LED STEPINDI1-STEPINDI4 = led:LED: LED OSRAM: - CHIPLED LG R971, LG N971, LY N971, LG Q971, LY Q971, LO R971, LY R971 LH N974, LH R974 LS Q976, LO Q976, LY Q976 LO Q996 - Hyper CHIPLED LW Q18S LB Q993, LB Q99A, LB R99A - SideLED LS A670, LO A670, LY A670, LG A670, LP A670 LB A673, LV A673, LT A673, LW A673 LH A674 LY A675 LS A676, LA A676, LO A676, LY A676, LW A676 LS A679, LY A679, LG A679 - Hyper Micro SIDELED® LS Y876, LA Y876, LO Y876, LY Y876 LT Y87S - SmartLED LW L88C, LW L88S LB L89C, LB L89S, LG L890 LS L89K, LO L89K, LY L89K LS L896, LA L896, LO L896, LY L896 - TOPLED LS T670, LO T670, LY T670, LG T670, LP T670 LSG T670, LSP T670, LSY T670, LOP T670, LYG T670 LG T671, LOG T671, LSG T671 LB T673, LV T673, LT T673, LW T673 LH T674 LS T676, LA T676, LO T676, LY T676, LB T676, LH T676, LSB T676, LW T676 LB T67C, LV T67C, LT T67C, LS T67K, LO T67K, LY T67K, LW E67C LS E67B, LA E67B, LO E67B, LY E67B, LB E67C, LV E67C, LT E67C LW T67C LS T679, LY T679, LG T679 LS T770, LO T770, LY T770, LG T770, LP T770 LB T773, LV T773, LT T773, LW T773 LH T774 LS E675, LA E675, LY E675, LS T675 LS T776, LA T776, LO T776, LY T776, LB T776 LHGB T686 LT T68C, LB T68C - Hyper Mini TOPLED® LB M676 - Mini TOPLED Santana® LG M470 LS M47K, LO M47K, LY M47K Source: http://www.osram.convergy.de LUXEON: - LUMILED® LXK2-PW12-R00, LXK2-PW12-S00, LXK2-PW14-U00, LXK2-PW14-V00 LXK2-PM12-R00, LXK2-PM12-S00, LXK2-PM14-U00 LXK2-PE12-Q00, LXK2-PE12-R00, LXK2-PE12-S00, LXK2-PE14-T00, LXK2-PE14-U00 LXK2-PB12-K00, LXK2-PB12-L00, LXK2-PB12-M00, LXK2-PB14-N00, LXK2-PB14-P00, LXK2-PB14-Q00 LXK2-PR12-L00, LXK2-PR12-M00, LXK2-PR14-Q00, LXK2-PR14-R00 LXK2-PD12-Q00, LXK2-PD12-R00, LXK2-PD12-S00 LXK2-PH12-R00, LXK2-PH12-S00 LXK2-PL12-P00, LXK2-PL12-Q00, LXK2-PL12-R00 Source: www.luxeon.com KINGBRIGHT: KA-3528ASYC Source: www.kingbright.com
SP-RC1 SP-RC2 = resistor:R-TRIMM: Trimm resistor
SP-SW2 = switch-dil:219-02*: Surface Mount DIP Switch Series 219 SMT CTS Electronic Components Sourc: www.ctscorp.com; OC_FARNELL: unknown; OC_NEWARK: unknown
SPI-LCD = 0@con-lsta:FE09-1: FEMALE HEADER; OC_FARNELL: unknown; OC_NEWARK: unknown
SPI-R = 0@Mylibrary-main1:XH-6: low insertion connector 6
STM-C1-STM-C6 = rcl:C-EU: CAPACITOR, European symbol
SUOPPLY-SW2 TOUCH1 TOUCH2 = forprint:XH-3: low insertion CON
SV1 = 0con-lstb:MA06-1: PIN HEADER; OC_FARNELL: unknown; OC_NEWARK: unknown
TO-UNDER = 0con-harting-ml:ML26: HARTING; OC_FARNELL: unknown; OC_NEWARK: unknown
TW-SP = 0@Mylibrary-main1:XH-2: low insertion CON
TWILITE = con-lstb-forprint:MA05-1: PIN HEADER; OC_FARNELL: unknown; OC_NEWARK: unknown
U2 = 23K256-I_SN:23K256-I/SN: None; AVAILABILITY: Good; DESCRIPTION: 23K256 Series 2.7 V to 3.6 V 256 kbit SPI Bus Low-Power Serial SRAM - SOIC-8; MF: Microchip; MP: 23K256-I/SN; PACKAGE: SOIC-8 Microchip; PRICE: 1.24 USD
U$2 = con-molex:5566-04A
X2 = kamiki-dcjack:DCJACK: DC JACK 2.1mmφ - 5.5mmφ DCジャック、基板用。
XB1 = maxstream:XBEE: XBee (TM) /XBee-PRO(TM) OEM RF Modules Source: MaxStream, Inc. xbee_productmanual.pdf; MPN: XBP24-AWI-001; OC_FARNELL: 1337916; OC_NEWARK: 42M2667